# EAGLE design lighting (EAGLE 9.6.2)
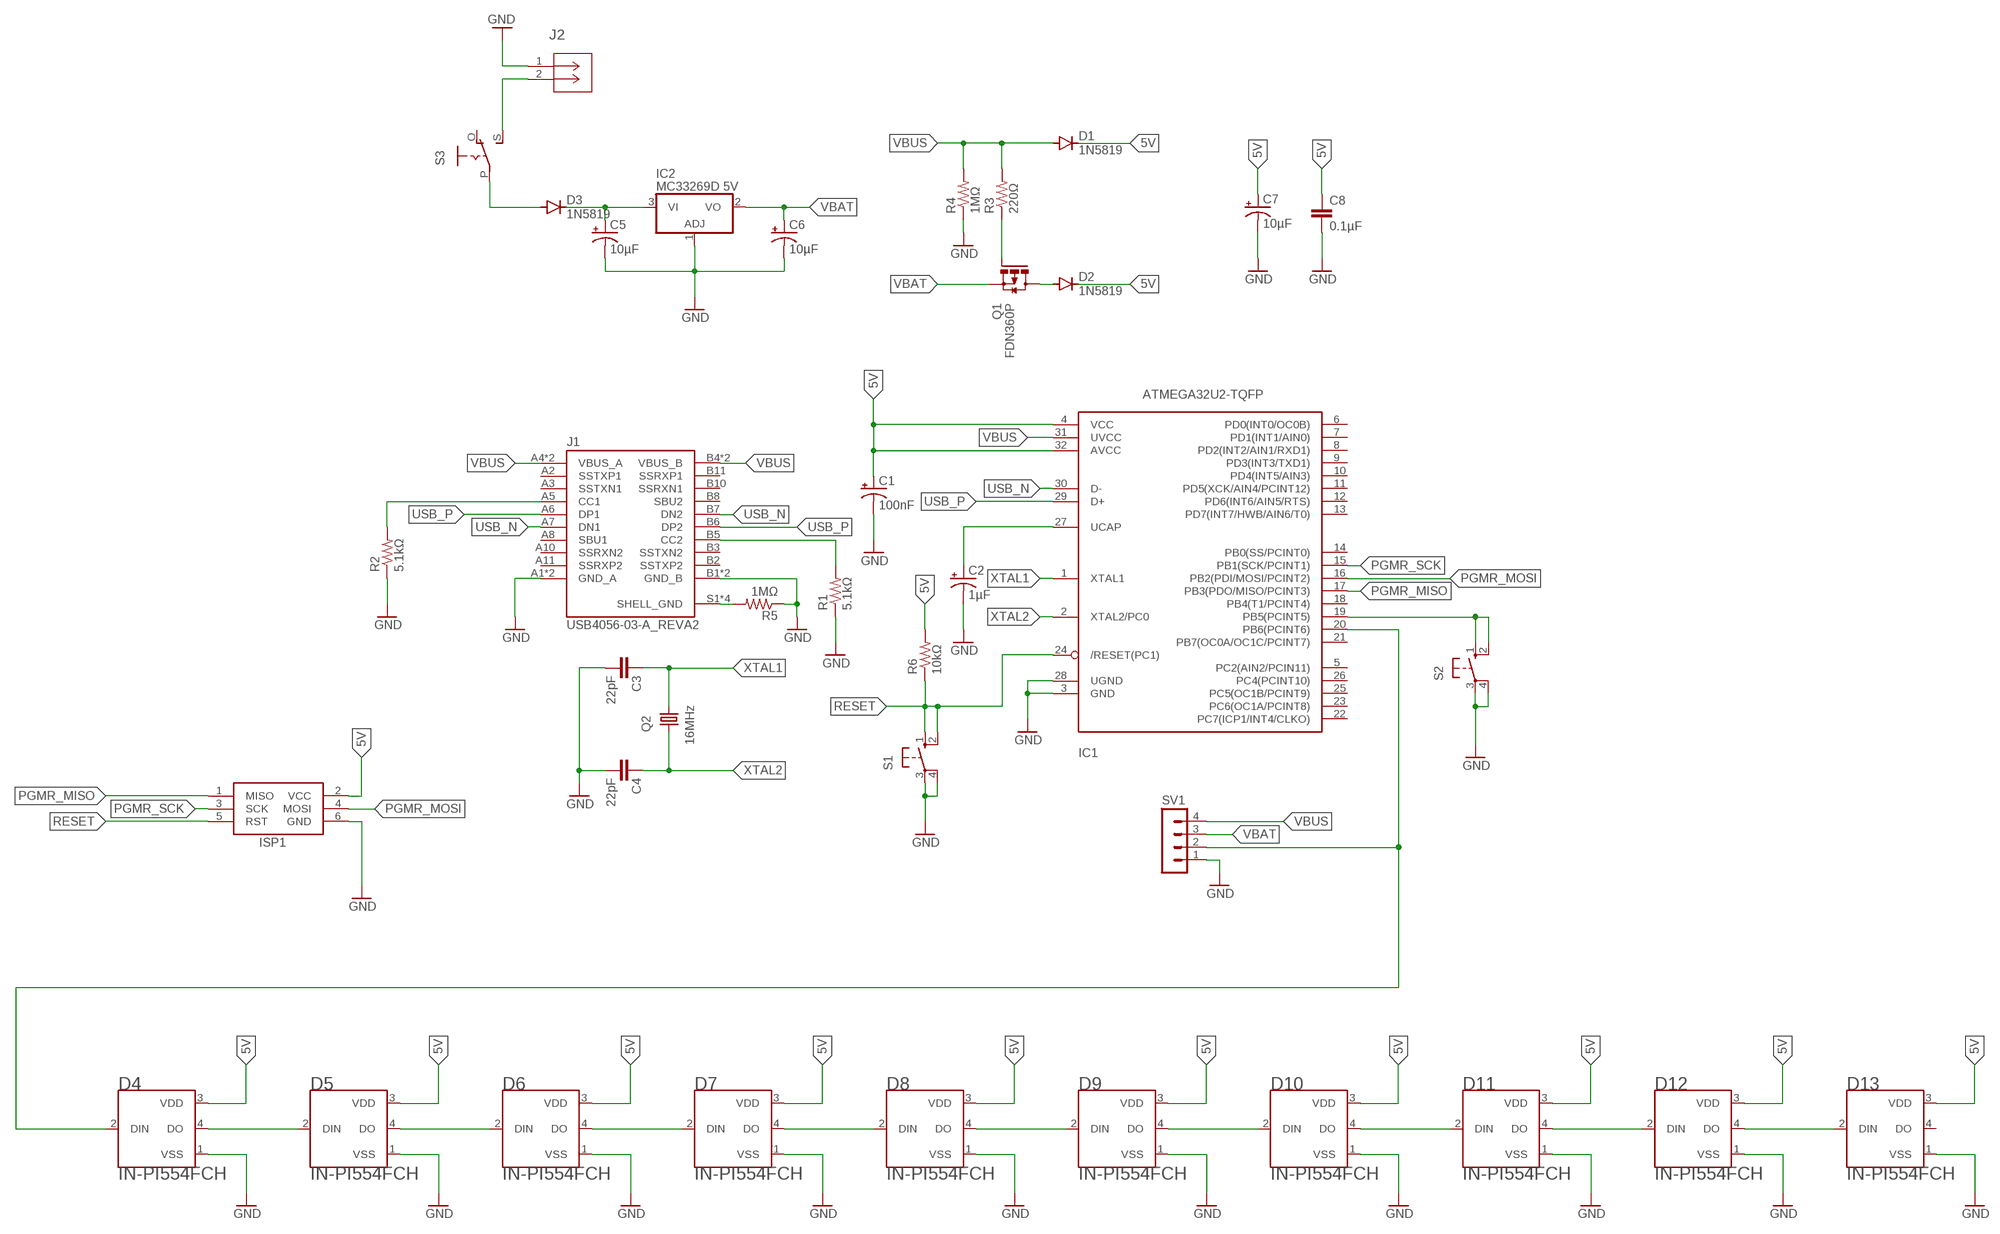
[diagram p0: schematic, sheet 1]

## Parts
C1  100nF  CPOL-USB  [PANASONIC_B]
C2  1µF  CPOL-USE2-5  [E2-5]
C3  22pF  C-EUC0402  [C0402]
C4  22pF  C-EUC0402  [C0402]
C5  10µF  CPOL-USB  [PANASONIC_B]
C6  10µF  CPOL-USB  [PANASONIC_B]
C7  10µF  CPOL-USB  [PANASONIC_B]
C8  0.1µF  C-EUC0402  [C0402]
D1  1N5819  DIODE-DO15-12  [DO15-12]
D2  1N5819  DIODE-DO15-12  [DO15-12]
D3  1N5819  DIODE-DO15-12  [DO15-12]
D4  IN-PI554FCH  [LED_IN-PI554FCH]
D5  IN-PI554FCH  [LED_IN-PI554FCH]
D6  IN-PI554FCH  [LED_IN-PI554FCH]
D7  IN-PI554FCH  [LED_IN-PI554FCH]
D8  IN-PI554FCH  [LED_IN-PI554FCH]
D9  IN-PI554FCH  [LED_IN-PI554FCH]
D10  IN-PI554FCH  [LED_IN-PI554FCH]
D11  IN-PI554FCH  [LED_IN-PI554FCH]
D12  IN-PI554FCH  [LED_IN-PI554FCH]
D13  IN-PI554FCH  [LED_IN-PI554FCH]
IC1  ATMEGA32U2-TQFP  [TQFP32-08]
IC2  MC33269D 5V  MC33269D  [DPACK]
ISP1  AVRISP-BOX  [AVRISP-BOX]
J1  USB4056-03-A_REVA2  [GCT_USB4056-03-A_REVA2]
J2  BH9VPC 9V  BH9VPC  [CONN_BH9VPC_MPD]
Q1  FDN360P  [SUPER-SOT3]
Q2  16MHz  CRYSTALHC49U-V  [HC49U-V]
R1  5.1kΩ  R-US_0207/10  [0207/10]
R2  5.1kΩ  R-US_0207/10  [0207/10]
R3  220Ω  R-US_0207/10  [0207/10]
R4  1MΩ  R-US_0207/10  [0207/10]
R5  1MΩ  R-US_0207/10  [0207/10]
R6  10kΩ  R-US_0207/10  [0207/10]
S1  10-XX  [B3F-10XX]
S2  10-XX  [B3F-10XX]
S3  EG1218S  [EG1218]
SV1  MA04-1  [MA04-1]

## Nets
5V: C1.+ C7.+ C8.1 D1.C D2.C D4.3(VDD) D5.3(VDD) D6.3(VDD) D7.3(VDD) D8.3(VDD) D9.3(VDD) D10.3(VDD) D11.3(VDD) D12.3(VDD) D13.3(VDD) IC1.4(VCC) IC1.32(AVCC) ISP1.2(VCC) R6.2
GND [GND]: C1.- C2.- C3.2 C4.2 C5.- C6.- C7.- C8.2 D4.1(VSS) D5.1(VSS) D6.1(VSS) D7.1(VSS) D8.1(VSS) D9.1(VSS) D10.1(VSS) D11.1(VSS) D12.1(VSS) D13.1(VSS) IC1.3(GND) IC1.28(UGND) IC2.1(ADJ) ISP1.6(GND) J1.A1(GND_A) J1.A12(GND_A) J1.B1(GND_B) J1.B12(GND_B) J2.1 R1.1 R2.1 R4.1 R5.1 S1.3(P) S1.4(P1) S2.3(P) S2.4(P1) SV1.1
N$1: J1.A5(CC1) R2.2
N$2: D2.A Q1.3(D)
N$3: J1.B5(CC2) R1.2
N$4: Q1.1(G) R3.1
N$5: J2.2 S3.S
N$6: C5.+ D3.C IC2.3(VI)
N$7: D4.4(DO) D5.2(DIN)
N$8: D5.4(DO) D6.2(DIN)
N$9: D6.4(DO) D7.2(DIN)
N$10: D7.4(DO) D8.2(DIN)
N$11: D8.4(DO) D9.2(DIN)
N$12: D9.4(DO) D10.2(DIN)
N$13: D10.4(DO) D11.2(DIN)
N$14: J1.S1(SHELL_GND) J1.S2(SHELL_GND) J1.S3(SHELL_GND) J1.S4(SHELL_GND) R5.2
N$15: D4.2(DIN) IC1.20(PB6(PCINT6)) SV1.2
N$16: C2.+ IC1.27(UCAP)
N$17: D3.A S3.P
N$18: IC1.19(PB5(PCINT5)) S2.1(S) S2.2(S1)
N$19: D11.4(DO) D12.2(DIN)
N$20: D12.4(DO) D13.2(DIN)
PGMR_MISO: IC1.17(PB3(PDO/MISO/PCINT3)) ISP1.1(MISO)
PGMR_MOSI: IC1.16(PB2(PDI/MOSI/PCINT2)) ISP1.4(MOSI)
PGMR_SCK: IC1.15(PB1(SCK/PCINT1)) ISP1.3(SCK)
RESET: IC1.24(/RESET(PC1)) ISP1.5(RST) R6.1 S1.1(S) S1.2(S1)
USB_N [diff pairs]: IC1.30(D-) J1.A7(DN1) J1.B7(DN2)
USB_P [diff pairs]: IC1.29(D+) J1.A6(DP1) J1.B6(DP2)
VBAT: C6.+ IC2.2(VO) Q1.2(S) SV1.3
VBUS: D1.A IC1.31(UVCC) J1.A4(VBUS_A) J1.A9(VBUS_A) J1.B4(VBUS_B) J1.B9(VBUS_B) R3.2 R4.2 SV1.4
XTAL1: C3.1 IC1.1(XTAL1) Q2.2
XTAL2: C4.1 IC1.2(XTAL2/PC0) Q2.1
Unconnected: D13.4(DO) IC1.5(PC2(AIN2/PCIN11)) IC1.6(PD0(INT0/OC0B)) IC1.7(PD1(INT1/AIN0)) IC1.8(PD2(INT2/AIN1/RXD1)) IC1.9(PD3(INT3/TXD1)) IC1.10(PD4(INT5/AIN3)) IC1.11(PD5(XCK/AIN4/PCINT12)) IC1.12(PD6(INT6/AIN5/RTS)) IC1.13(PD7(INT7/HWB/AIN6/T0)) IC1.14(PB0(SS/PCINT0)) IC1.18(PB4(T1/PCINT4)) IC1.21(PB7(OC0A/OC1C/PCINT7)) IC1.22(PC7(ICP1/INT4/CLKO)) IC1.23(PC6(OC1A/PCINT8)) IC1.25(PC5(OC1B/PCINT9)) IC1.26(PC4(PCINT10)) J1.A2(SSTXP1) J1.A3(SSTXN1) J1.A8(SBU1) J1.A10(SSRXN2) J1.A11(SSRXP2) J1.B2(SSTXP2) J1.B3(SSTXN2) J1.B8(SBU2) J1.B10(SSRXN1) J1.B11(SSRXP1) S3.O

## Library data of the parts
C1 C2 C5-C7 = adafruit:CPOL-US: POLARIZED CAPACITOR, American symbol
C3 C4 C8 = rcl:C-EU: CAPACITOR, European symbol; SPICEPREFIX: C
D1-D3 = diode:DIODE-: DIODE
D4-D13 = IN-PI554FCH:IN-PI554FCH: 5050RGB with integrated IC built in 4 PIN Viewing angle: 120 degrees; MANUFACTURER: Inolux
IC1 = adafruit:ATMEGA32U2: ATmega32u2 Pin compatible with the atmega8u2, atmega16u2 and atmega32u2 8, 16 or 32 K flash, 1K RAM, 512b EEPROM 8 bit and 16 bit timer (5 PWM total) UART, SPI (no I2C!) USB with 4 endpoints, LUFA compatible 22 I/O lines, analog comparator (no ADC!) Comes with DFU bootloader burned in!
IC2 = linear:MC33269?*: Adjustable Output Low Dropout Voltage Regulator 800 mA Source: http://www.onsemi.com/pub/Collateral/MC33269-D.PDF
ISP1 = adafruit:AVRISP: AVR ISP HEADER Standard 6 pin header for AVR programming
J1 = USB4056-03-A_REVA2:USB4056-03-A_REVA2; MANUFACTURER: GCT; MAXIMUM_PACKAGE_HEIGHT: 3.31 mm; PARTREV: A2; SNAPEDA_PN: USB4056-03-A; STANDARD: Manufacturer Recommendations
J2 = components:BH9VPC; COPYRIGHT: Copyright (C) 2024 Ultra Librarian. All rights reserved.; MANUFACTURER_PART_NUMBER: BH9VPC; MFR_NAME: Memory Protection Devices
Q1 = transistor-power:FDN360P: Single P-Channel, PowerTrench (R) MOSFET Source: http://www.fairchildsemi.com/ds/FD/FDN360P.pdf
Q2 = crystal:CRYSTAL: CRYSTAL; OC_FARNELL: 1666969; OC_NEWARK: unknown
R1-R6 = adafruit:R-US_: RESISTOR, American symbol
S1 S2 = switch-omron:10-XX: OMRON SWITCH; MPN: B3F-1000; OC_FARNELL: 176432; OC_NEWARK: 36M3542
S3 = adafruit:EG1218: SLIDING SWITCH 0.1" spacing through hole, vertical SPDT slide switch http://www.ladyada.net/library/pcb/eaglelibrary.html
SV1 = con-lstb:MA04-1: PIN HEADER; OC_FARNELL: unknown; OC_NEWARK: unknown

## Net classes
1 diff pairs: width 0.203 mm
2 GND: clearance 0.254 mm to class 1

## Board
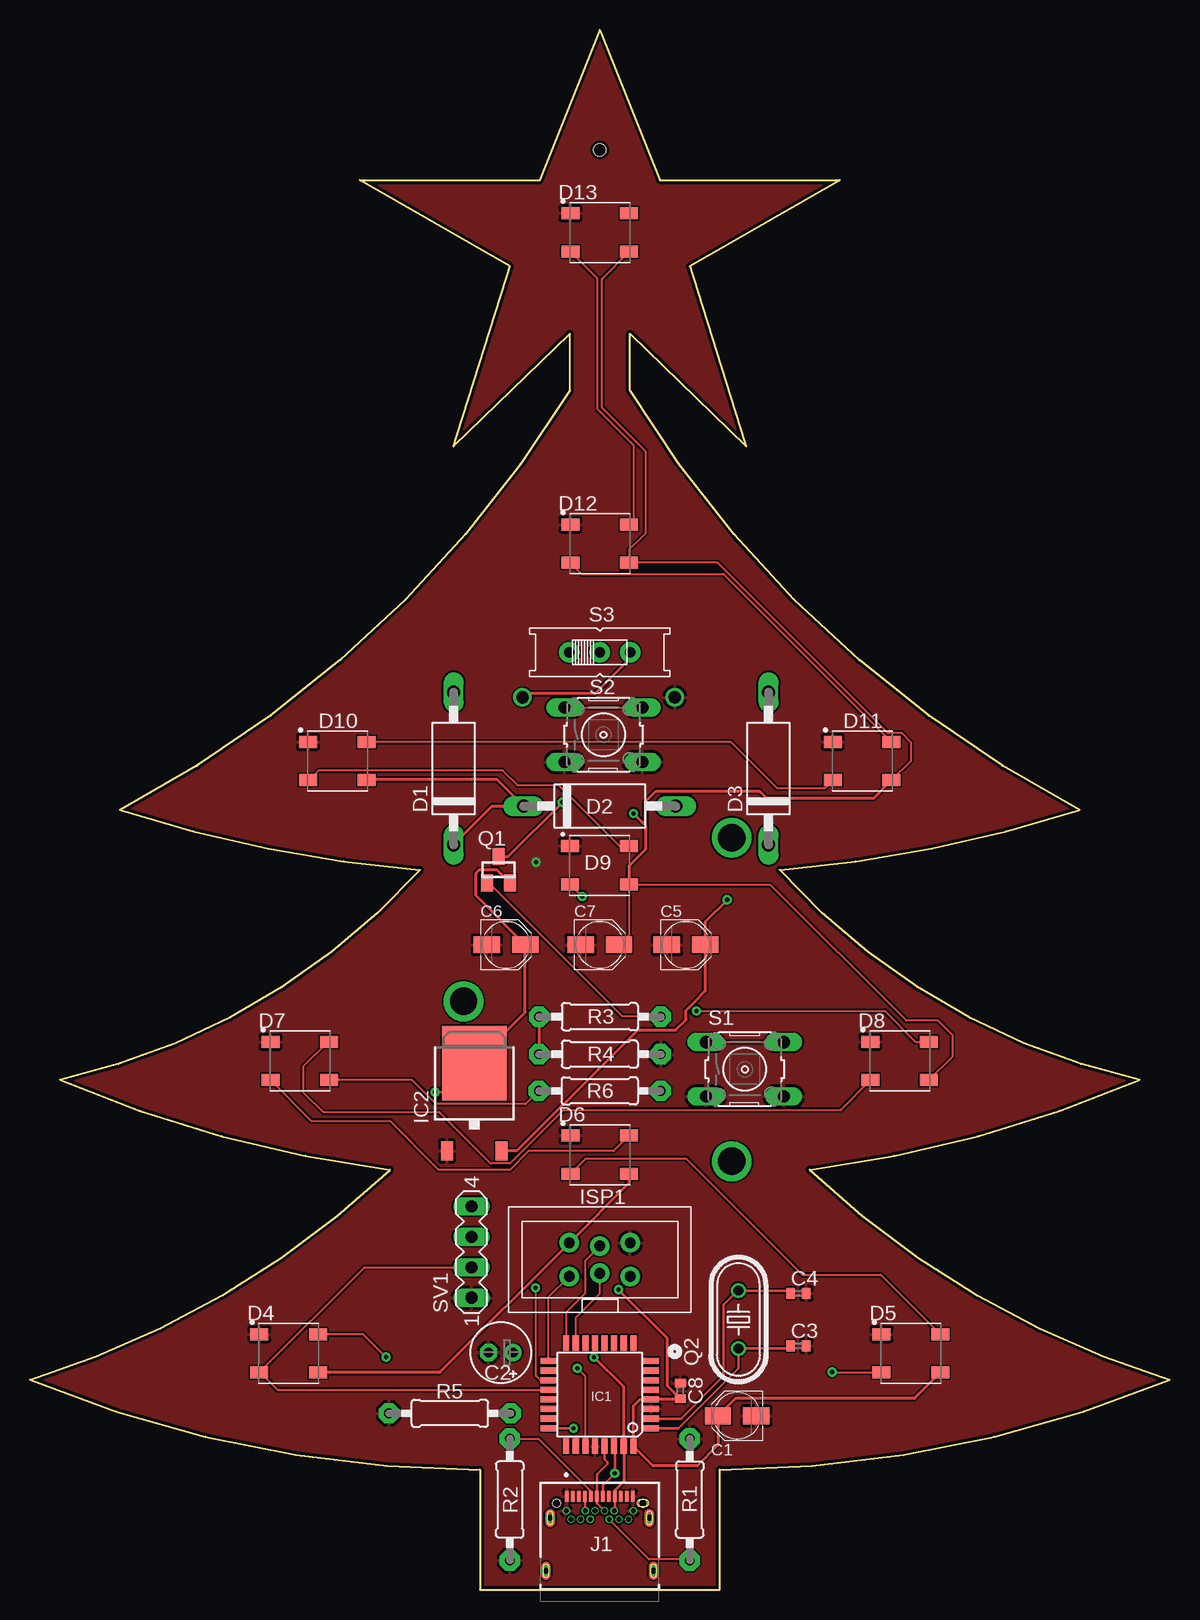
[diagram p1: board, top side]
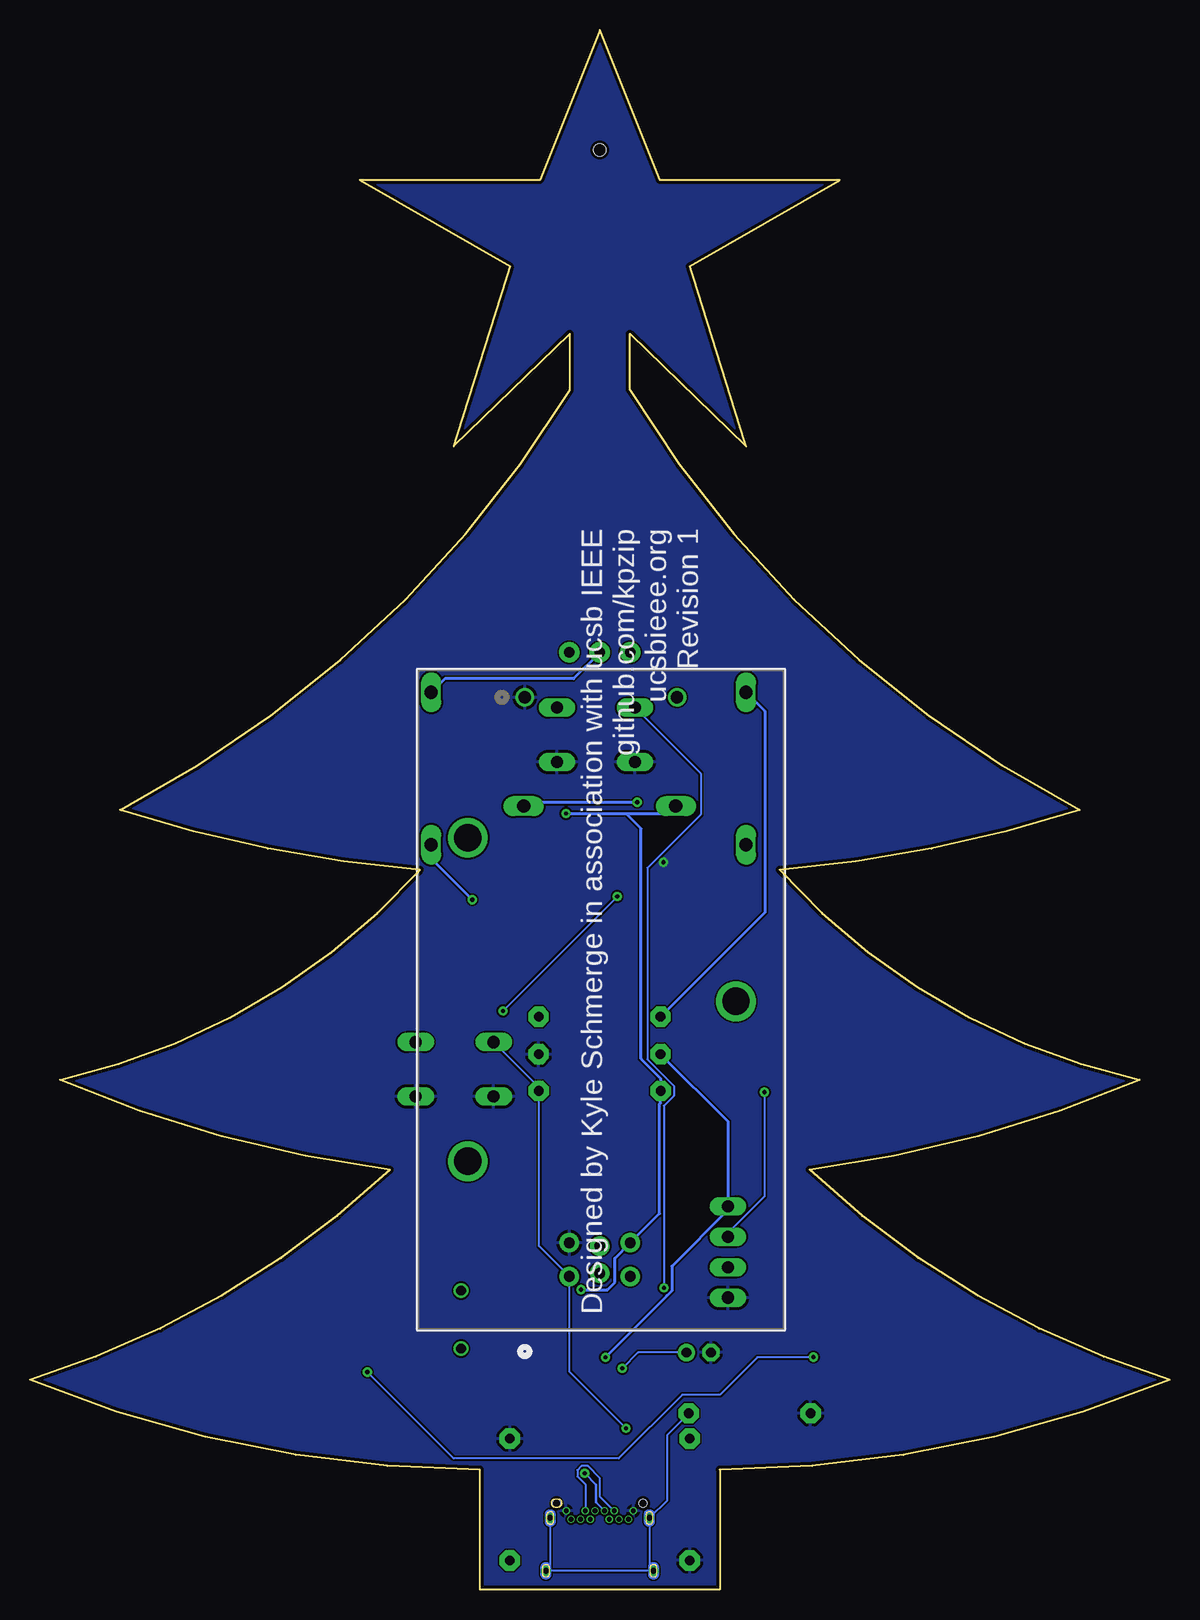
[diagram p2: board, bottom side, seen from below]

Size 95 x 130 mm. Coordinates in mm from the lower left corner, seen from the top.
Outline: 37.5,10 37.5,0 57.5,0 57.5,10 arc22 95,17.5 arc-27 65,35 arc16 92.5,42.5 arc-36 62.5,60 arc14 87.5,65 arc-31 50,100 50,104.69 59.69,95.31 55,110.31 67.5,117.5 52.5,117.5 47.5,130 42.5,117.5 27.5,117.5 40,110.31 35.31,95.31 45,104.69 45,100 arc-31 7.5,65 arc14 32.5,60 arc-36 2.5,42.5 arc16 30,35 arc-27 0,17.5 arc22 37.5,10
Copper layers (1*16): Top 0.035mm / dielectric 1.5mm / Bottom 0.035mm
Design rules "default *": minimum track width 6mil, minimum drill 0.35mm, track to track 6mil, track to pad 6mil, pad to pad 6mil, via to via 6mil, smd to smd 6mil, copper to edge 10mil, drill to drill 6mil, minimum pad ring 0.1mm, minimum via ring 8mil, stop-mask expansion 4mil, vias tented up to drill 0mil, thermal gap 10mil
Holes 1 mm at 47.5,120

### Footprints (pad centres in the part's own frame; a part is rotated, then mirrored left to right if it is on the bottom)
PANASONIC_B = smd 2.2 x 1.4: + 1.6,0; - -1.6,0
E2-5 = drill 0.813 pad 1.422: + -1.016,0 | drill 0.813 pad 1.422 octagon: - 1.016,0
C0402 = smd 0.7 x 0.9: 1 -0.65,0; 2 0.65,0
DO15-12 = drill 1.118 long: A 6.35,0; C -6.35,0
LED_IN-PI554FCH = smd 1.5 x 1: 1 -2.45,1.6; 2 -2.45,-1.6; 3 2.45,-1.6; 4 2.45,1.6
TQFP32-08 = smd 1.27 x 0.508: 1 -4.293,2.8; 2 -4.293,2; 3 -4.293,1.2; 4 -4.293,0.4; 5 -4.293,-0.4; 6 -4.293,-1.2; 7 -4.293,-2; 8 -4.293,-2.8; 17 4.293,-2.8; 18 4.293,-2; 19 4.293,-1.2; 20 4.293,-0.4; 21 4.293,0.4; 22 4.293,1.2; 23 4.293,2; 24 4.293,2.8 | smd 0.508 x 1.27: 9 -2.8,-4.293; 10 -2,-4.293; 11 -1.2,-4.293; 12 -0.4,-4.293; 13 0.4,-4.293; 14 1.2,-4.293; 15 2,-4.293; 16 2.8,-4.293; 25 2.8,4.293; 26 2,4.293; 27 1.2,4.293; 28 0.4,4.293; 29 -0.4,4.293; 30 -1.2,4.293; 31 -2,4.293; 32 -2.8,4.293
DPACK = smd 1 x 1.6: 1 -2.28,-4.8; 3 2.28,-4.8 | smd 5.4 x 6.2: 2 0,2.5
AVRISP-BOX = drill 0.9 pad 1.626: 1 -1.397,2.54; 2 1.397,2.54; 3 -1.143,0; 4 1.143,0; 5 -1.397,-2.54; 6 1.397,-2.54
GCT_USB4056-03-A_REVA2 = smd 0.3 x 0.9: A1 -2.75,6.2; A2 -2.25,6.2; A3 -1.75,6.2; A4 -1.25,6.2; A5 -0.75,6.2; A6 -0.25,6.2; A7 0.25,6.2; A8 0.75,6.2; A9 1.25,6.2; A10 1.75,6.2; A11 2.25,6.2; A12 2.75,6.2 | drill 0.4 pad 0.6: B1 2.8,4.99; B2 2.4,4.29; B3 1.6,4.29; B4 1.2,4.99; B5 0.8,4.29; B6 0.4,4.99; B7 -0.4,4.99; B8 -0.8,4.29; B9 -1.2,4.99; B10 -1.6,4.29; B11 -2.4,4.29; B12 -2.8,4.99 | drill 0.5 pad 0.8: S1 -4.13,4.4; S2 4.13,4.4; S3 -4.49,0; S4 4.49,0 | hole 0.65: 3.6,5.64; -3.6,5.64
CONN_BH9VPC_MPD = drill 1.016 pad 1.524: 1 0,0; 2 0,-12.7 | drill 2.286 pad 2.286: 3 -38.684,4.75; 4 -11.709,4.75; 5 -25.349,-17.602
SUPER-SOT3 = smd 1 x 1.4: 1 -0.95,-1.1; 2 0.95,-1.1; 3 0,1.1
HC49U-V = drill 0.813: 1 -2.413,0; 2 2.413,0
0207/10 = drill 0.813 pad 1.676 octagon: 1 -5.08,0; 2 5.08,0
B3F-10XX = drill 1.016 long: 1 -3.251,2.261; 2 3.251,2.261; 3 -3.251,-2.261; 4 3.251,-2.261
EG1218 = drill 0.9 pad 1.676: O -2.54,0; P 0,0; S 2.54,0
MA04-1 = drill 1.016 long: 1 -3.81,0; 2 -1.27,0; 3 1.27,0; 4 3.81,0

### Placement (x,y rotation side)
C1  58.96,14.48 180 top
C2  39.25,19.75 180 top
C3  64.06,20.31 0 top
C4  64.06,24.69 0 top
C5  54.69,53.75 0 top
C6  39.69,53.75 0 top
C7  47.5,53.75 0 top
C8  54.22,16.56 90 top
D1  35.31,68.44 90 top
D2  47.5,65.31 0 top
D3  61.56,68.44 90 top
D4  21.56,19.69 0 top
D5  73.44,19.69 0 top
D6  47.5,36.25 0 top
D7  22.5,44.06 0 top
D8  72.5,44.06 0 top
D9  47.47,60.38 0 top
D10  25.62,69.06 0 top
D11  69.38,69.06 0 top
D12  47.5,87.19 0 top
D13  47.5,113.12 0 top
IC1  47.5,16.25 180 top
IC2  37.04,41.36 0 top
ISP1  47.5,27.5 90 top
J1  47.5,1.56 0 top
J2  53.75,74.38 90 bottom
Q1  39.06,60 0 top
Q2  59.06,22.5 270 top
R1  55,7.5 270 top
R2  40,7.5 90 top
R3  47.51,47.75 180 top
R4  47.51,44.62 180 top
R5  35,14.69 0 top
R6  47.5,41.56 180 top
S1  59.59,43.37 0 top
S2  47.81,71.25 0 top
S3  47.5,78.12 0 top
SV1  36.81,28.14 90 top

### Tracks (layer width: path | path; a pad name or v marks a point on that pad's centre or on a via)
5V  (via drill 0.35)
  Top 0.152: R6.2 42.38,41.53 41.31,40.47 33.85,40.47 31.85,42.46 D7.3 | 49.93,60.31 49.93,58.83 D9.3 49.92,58.75 | 50.85,15.85 50.94,15.85 | 49.92,58.75 49.92,54.57 C7.+ | 24.06,18.09 D4.3 | 28.13,67.52 D10.3 | D8.3 76.88,44.39 76.88,46.25 75.7,47.43 73.05,47.43 61.73,58.75 49.92,58.75 | D11.3 73.44,69.08 73.44,70.62 72.67,71.39 71.53,71.39 57.29,85.62 49.95,85.62 | 49.95,85.62 49.95,86.67 51.3,88.01 51.3,94.89 47.67,98.52 47.67,109.25 D13.3 | 49.95,85.62 D12.3 | 51.31,63.69 51.31,63.75
  Top 0.254: D5.3 73.74,15.94 58.82,15.94 C1.+ 57.36,12.04 55.62,10.31 51.95,10.31 IC1.32 50.3,15.3 50.85,15.85 | 50.94,15.85 IC1.4 51.85,15.91 C8.1 53.12,17 53.12,20.94 v49.06,25 | D6.3 49.95,33.89 ISP1.2 34.15,18.09 24.06,18.09 | D1.C 38.54,65.31 D2.C 38.95,67.52 28.13,67.52 | v50.31,64.69 51.31,63.69 51.31,61.7 49.93,60.31 49.92,60.31 49.92,58.75 | 51.31,63.75 51.31,65.69 52.19,66.56 60.83,66.56 61.4,65.99 70.36,65.99 D11.3
  Bottom 0.254: v49.06,25 46.88,25 46.25,25.62 46.25,27.61 ISP1.2 42.51,31.35 42.51,40.46 42.42,40.55 R6.2 42.42,42.59 44.06,44.23 44.06,63.44 45.31,64.69 | v50.31,64.69 45.31,64.69 | 45.31,64.69 41.77,64.69 D2.C
GND  (via drill 0.35)
  other vias: 42.19,60.62
  pour Top: -15.62,-22.5 120,-22.5 120,137.81 -15.62,137.81
  pour Bottom: -15.62,-20 120,-20 120,137.81 -15.62,137.81
N$1
  Top 0.152: J1.A5 46.73,7.78 46.73,8.23 42.38,12.58 40.02,12.58 R2.2
N$2  (via drill 0.35)
  Top 0.254: Q1.3 39.85,61.1 v44.38,65.62
  Bottom 0.254: v44.38,65.62 53.54,65.62 D2.A
N$3
  Top 0.152: J1.B5 48.33,5.79 51.6,2.52 54.88,2.52 54.95,2.44 R1.2
N$4
  Top 0.152: R3.1 52.52,47.78 49.41,47.78 38.29,58.9 Q1.1
N$5
  Top 0.254: J2.2 41.36,74.69 47.11,74.69 50.04,77.61 S3.S
N$6  (via drill 0.35)
  Top 0.152: 39.33,36.58 IC2.3
  Top 0.254: v58.12,57.5 56.29,55.66 C5.+ 56.29,49.88 55.31,48.9 55.29,48.9 54.69,48.29 54.69,47.5 53.82,46.63 50.68,46.63 44.41,40.36 44.34,40.36 40.56,36.58 39.33,36.58
  Bottom 0.254: D3.C 61.56,60.94 v58.12,57.5
N$7  (via drill 0.35)
  Top 0.152: v66.88,18.12 70.95,18.12 D5.2 | v29.69,19.38 27.77,21.29 D4.4
  Bottom 0.152: v29.69,19.38 34.38,19.38 37.5,16.25 40.62,16.25 45.94,10.94 59.69,10.94 v66.88,18.12
N$8
  Top 0.152: D6.2 46.34,35.94 54.69,35.94 64.38,26.25 70.92,26.25 D5.4
N$9
  Top 0.152: D6.4 48.66,36.56 41.56,36.56 40,35 34.06,35 30,39.06 23.45,39.06 D7.2
N$10
  Top 0.152: D7.4 24.85,45.66 22.79,43.61 22.79,41.45 24.47,39.77 34.15,39.77 38.41,35.51 40,35.51 44.49,40 67.59,40 D8.2
N$11  (via drill 0.35)
  Top 0.152: v55.56,48.24 71.25,48.24 73.83,45.66 D8.4 | v46.04,57.76 45.05,58.75 D9.2
  Bottom 0.152: v46.04,57.76 v55.56,48.24
N$12
  Top 0.152: D9.4 49.85,62.03 49.09,62.03 44.06,67.06 40.63,67.06 39.41,68.28 24.06,68.28 23.25,67.46 D10.2
N$13
  Top 0.152: D10.4 28.09,70.64 58.46,70.64 62.27,66.83 66.29,66.83 D11.2
N$14
  Bottom 0.152: R5.2 41.88,12.89 41.88,7.46 J1.S1 43.37,1.81 43.12,1.56 | J1.S3 J1.S4 51.63,1.92 J1.S2
  Bottom 0.203: J1.S3 43.12,1.56
N$15
  Top 0.152: SV1.2 27.89,26.87 D4.2 19.19,18.09 20.62,16.65 IC1.20
N$16  (via drill 0.35)
  Top 0.152: IC1.27 46.3,17.76 v45.62,18.44
  Bottom 0.152: C2.+ 44.31,19.75 v45.62,18.44
N$17
  Bottom 0.254: S3.P 49.69,75.94 60.41,75.94 D3.A
N$18  (via drill 0.35)
  Top 0.152: v42.15,25.15 42.15,17.91 42.19,17.81 | S2.1 S2.2
  Top 0.203: IC1.19 42.55,17.45 42.19,17.81
  Bottom 0.152: v42.15,25.15 42.15,40.31 41.31,41.15 41.31,41.99 43.52,44.2 43.52,60.15 39.07,64.6 39.07,68.02 S2.1
N$19
  Top 0.152: D11.4 57.83,84.66 46.25,84.66 46.19,84.66 45.98,84.66 D12.2
N$20
  Top 0.152: D12.4 50.31,89.14 50.31,95.41 47.3,98.42 47.3,109.27 D13.2
PGMR_MISO
  Top 0.152: ISP1.1 43.21,24.35 IC1.17
PGMR_MOSI
  Top 0.152: ISP1.4 46.25,27.39 46.25,24.69 44.69,23.12 44.69,20.55 IC1.16
PGMR_SCK
  Top 0.152: ISP1.3 47.5,24.69 45.5,22.69 IC1.15
RESET  (via drill 0.35)
  Top 0.152: S1.2 62.8,45.65 56.4,45.65 S1.1
  Top 0.203: v45.31,13.44 43.22,13.44 IC1.24
  Bottom 0.152: v45.31,13.44 50.04,18.16 ISP1.5 52.58,28.64 R6.1 | 52.58,41.87 S1.1
  Bottom 0.203: R6.1 52.58,41.87
USB_N  (via drill 0.35)
  Top 0.203: J1.A7 47.75,8.69 v48.75,9.69 48.75,11.91 IC1.30
  Bottom 0.203: J1.B7 47.81,7.26 47.81,8.75 v48.75,9.69
USB_P
  Top 0.203: J1.B6 47.25,7.2 J1.A6 47.25,9.62 48.12,10.5 48.12,10.62 47.9,10.85 IC1.29
VBAT  (via drill 0.35)
  Top 0.152: v33.77,41.46 34.61,41.46 36.97,43.82 IC2.2 | 37.2,59.74 37.2,59.69
  Top 0.254: IC2.2 41.29,48.11 C6.+ 37.2,57.84 37.2,59.69 | Q1.2 38.94,59.97 37.43,59.97 37.2,59.74
  Bottom 0.152: v33.77,41.46 33.77,32.77 36.74,29.8 36.74,29.42 SV1.3
VBUS  (via drill 0.35)
  Top 0.152: 48.78,8.12 48.78,7.85 J1.A9 | 49.47,11.97 IC1.31
  Top 0.203: J1.A9 48.75,6.6 J1.B4 | J1.A4 46.25,6.6 J1.B9
  Top 0.254: R3.2 R4.2 | v47.03,19.36 49.47,16.92 49.47,11.97 | IC1.31 49.5,9.01 48.78,8.29 48.78,8.12
  Bottom 0.152: J1.B4 48.7,8.78 49.36,9.44 49.36,9.94 49,10.29 48.5,10.29 47.48,9.28 47.48,7.74 J1.B9
  Bottom 0.254: D1.A 33.75,73.22 33.75,56.43 R3.2 | R4.2 36.81,39 SV1.4 36.81,31.64 41.5,26.96 41.5,24.88 41.88,24.49 41.9,24.49 v47.03,19.36
XTAL1
  Top 0.203: IC1.1 54.08,13.45 59.06,18.44 Q2.2 63.19,20.09 C3.1
XTAL2
  Top 0.203: IC1.2 54.25,14.25 57.81,17.81 57.81,23.75 58.98,24.91 Q2.1 63.19,24.91 C4.1

### Text on the board
bNames: Designed by Kyle Schmerge in association with ucsb IEEE / github.com/kpzip / ucsbieee.org / Revision 1